# EAGLE schematic LFSR (EAGLE 7.3.0)
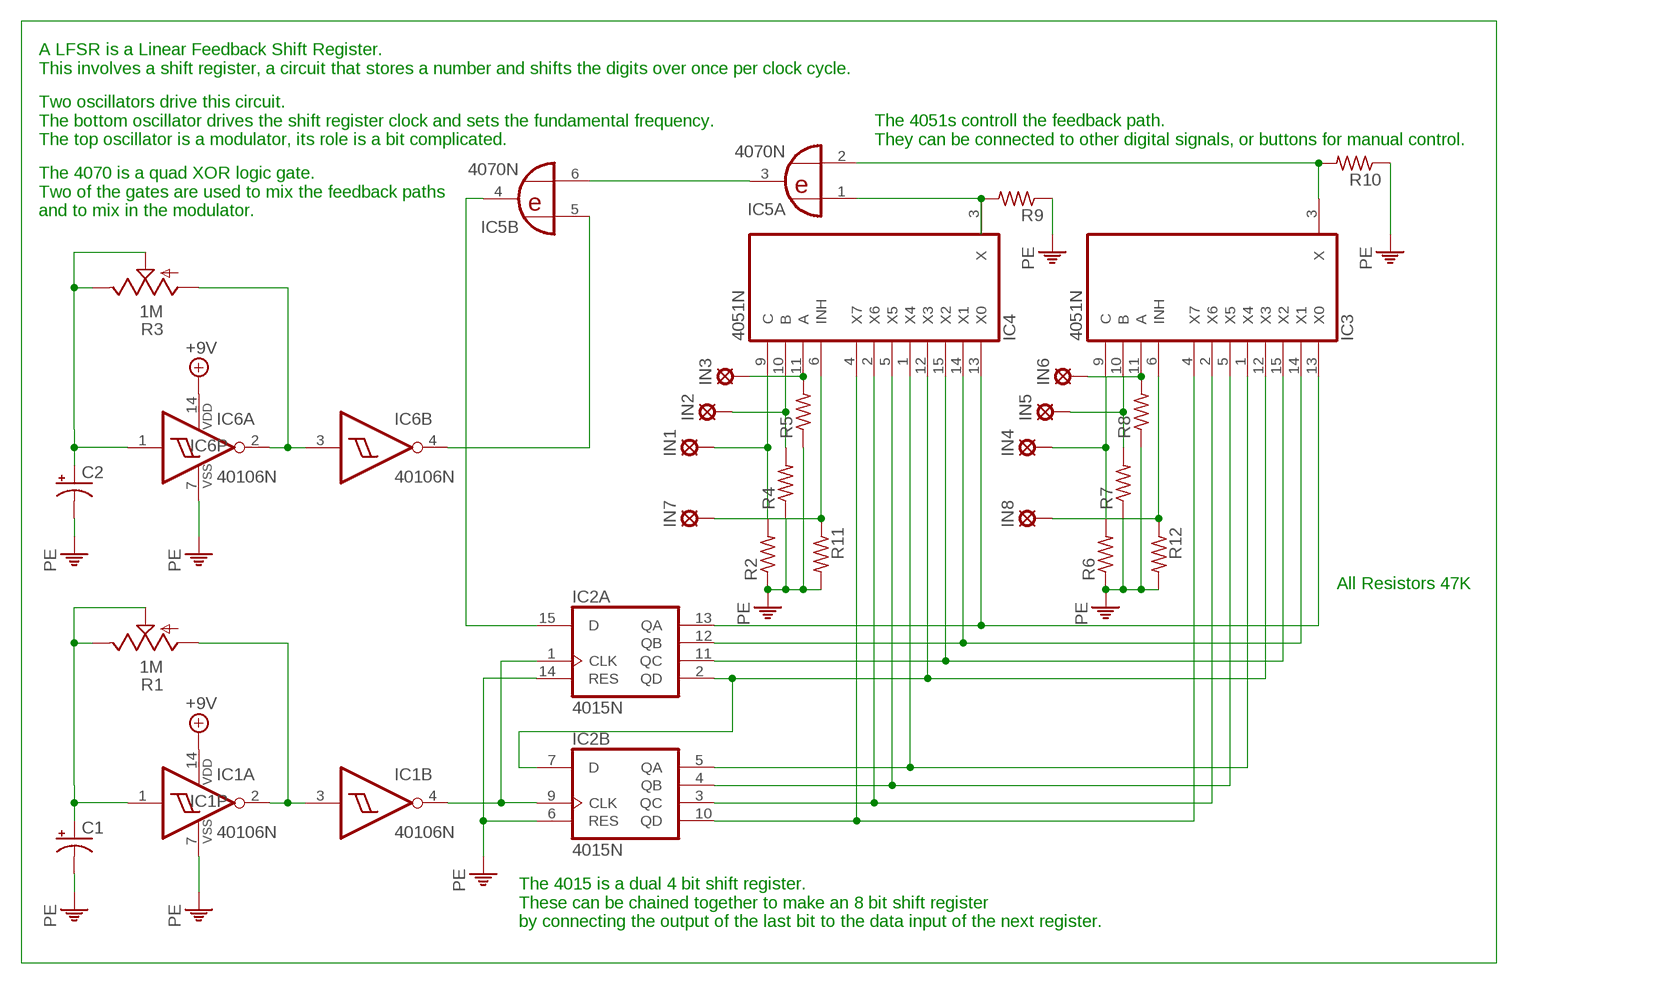
[diagram p0: schematic, sheet 1]

## Parts
C1  CPOL-USE2,5-6E  [E2,5-6E]
C2  CPOL-USE2,5-6E  [E2,5-6E]
IC1  40106N  [DIL14]
IC2  4015N  [DIL16]
IC3  4051N  [DIL16]
IC4  4051N  [DIL16]
IC5  4070N  [DIL14]
IC6  40106N  [DIL14]
IN1  MCS10B  [MCS10B]
IN2  MCS10B  [MCS10B]
IN3  MCS10B  [MCS10B]
IN4  MCS10B  [MCS10B]
IN5  MCS10B  [MCS10B]
IN6  MCS10B  [MCS10B]
IN7  MCS10B  [MCS10B]
IN8  MCS10B  [MCS10B]
R1  1M  US-EVUF2A  [EVUF]
R2  R-US_0204/7  [0204/7]
R3  1M  US-EVUF2A  [EVUF]
R4  R-US_0204/7  [0204/7]
R5  R-US_0204/7  [0204/7]
R6  R-US_0204/7  [0204/7]
R7  R-US_0204/7  [0204/7]
R8  R-US_0204/7  [0204/7]
R9  R-US_0204/7  [0204/7]
R10  R-US_0204/7  [0204/7]
R11  R-US_0204/7  [0204/7]
R12  R-US_0204/7  [0204/7]

## Nets
+9V: IC1.14(P:VDD) IC6.14(P:VDD)
N$1: IC2.13(A:QA) IC3.13(X0) IC4.13(X0)
N$2: IC1.4(B:O) IC2.1(A:CLK) IC2.9(B:CLK)
N$3: IC1.2(A:O) IC1.3(B:I) R1.1(A)
N$4: R1.2(S) R1.3(E)
N$5: IC2.12(A:QB) IC3.14(X1) IC4.14(X1)
N$6: IC2.11(A:QC) IC3.15(X2) IC4.15(X2)
N$7: IC2.2(A:QD) IC2.7(B:D) IC3.12(X3) IC4.12(X3)
N$8: IC2.5(B:QA) IC3.1(X4) IC4.1(X4)
N$9: IC2.4(B:QB) IC3.5(X5) IC4.5(X5)
N$10: IC2.3(B:QC) IC3.2(X6) IC4.2(X6)
N$11: IC2.10(B:QD) IC3.4(X7) IC4.4(X7)
N$12: IC4.3(X) IC5.1(A:I0) R9.2
N$13: IC3.3(X) IC5.2(A:I1) R10.2
N$14: IC5.3(A:O) IC5.6(B:I1)
N$15: IC2.15(A:D) IC5.4(B:O)
N$16: IC5.5(B:I0) IC6.4(B:O)
N$17: IC6.2(A:O) IC6.3(B:I) R3.1(A)
N$18: C2.+ IC6.1(A:I)
N$19: R3.2(S) R3.3(E)
N$20: IC4.11(A) IN3.MP R5.2
N$21: IC4.9(C) IN1.MP R2.2
N$22: IC4.10(B) IN2.MP R4.2
N$23: IC3.11(A) IN6.MP R8.2
N$24: IC3.10(B) IN5.MP R7.2
N$25: IC3.9(C) IN4.MP R6.2
N$26: IC4.6(INH) IN7.MP R11.1
N$27: IC3.6(INH) IN8.MP R12.1
N$28: C1.+ IC1.1(A:I)
PE: C1.- C2.- IC1.7(P:VSS) IC2.6(B:RES) IC2.14(A:RES) IC6.7(P:VSS) R2.1 R4.1 R5.1 R6.1 R7.1 R8.1 R9.1 R10.1 R11.2 R12.2
Unconnected: IC1.5(C:I) IC1.6(C:O) IC1.8(D:O) IC1.9(D:I) IC1.10(E:O) IC1.11(E:I) IC1.12(F:O) IC1.13(F:I) IC5.8(C:I0) IC5.9(C:I1) IC5.10(C:O) IC5.11(D:O) IC5.12(D:I0) IC5.13(D:I1) IC6.5(C:I) IC6.6(C:O) IC6.8(D:O) IC6.9(D:I) IC6.10(E:O) IC6.11(E:I) IC6.12(F:O) IC6.13(F:I)

## Notes on the sheet
- A LFSR is a Linear Feedback Shift Register.
  This involves a shift register, a circuit that stores a number and shifts the digits over once per clock cycle.
- Two oscillators drive this circuit.
  The bottom oscillator drives the shift register clock and sets the fundamental frequency.
  The top oscillator is a modulator, its role is a bit complicated.
- The 4051s controll the feedback path.
  They can be connected to other digital signals, or buttons for manual control.
- The 4070 is a quad XOR logic gate.
  Two of the gates are used to mix the feedback paths
  and to mix in the modulator.
- All Resistors 47K
- The 4015 is a dual 4 bit shift register.
  These can be chained together to make an 8 bit shift register
  by connecting the output of the last bit to the data input of the next register.

## Power pins joined to a net without a drawn wire
GND: IC3.8(GND) IC4.8(GND)
VCC: IC3.16(VCC) IC4.16(VCC)
VDD: IC2.16(P:VDD) IC5.14(P:VDD)
VEE: IC3.7(VEE) IC4.7(VEE)
VSS: IC2.8(P:VSS) IC5.7(P:VSS)

## Library data of the parts
C1 C2 = rcl:CPOL-US: POLARIZED CAPACITOR, American symbol
IC1 IC6 = 40xx:40106: Hex SCHMITT TRIGGER
IC2 = 40xx:4015: Dual 4-bit static SHIFT REGISTER
IC3 IC4 = 40xx:4051: 8-channel ANALOG MULTIPLEXER
IC5 = 40xx:4070: Quad 2-input XOR
IN1-IN8 = solpad:MCS10B: SOLDER PAD MC S1, distributor Buerklin, 15F505
R1 R3 = pot:US-EVU: 9 mm Square Rotary Potentiometers Source: Panasonic
R2 R4-R12 = rcl:R-US_: RESISTOR, American symbol